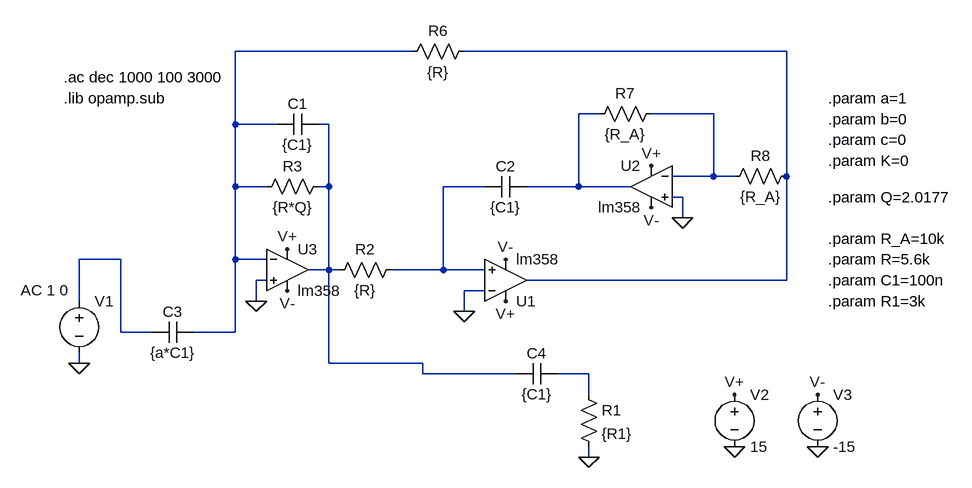
[diagram p0: schematic Labo1_V2.asc]
Labo1_V2.asc, the LTspice schematic file:
Version 4.1
SHEET 1 1576 828
WIRE 224 -192 -48 -192
WIRE 800 -192 304 -192
WIRE 512 -96 480 -96
WIRE 688 -96 592 -96
WIRE -48 -80 -48 -192
WIRE 16 -80 -48 -80
WIRE 96 -80 80 -80
WIRE 688 0 688 -96
WIRE 688 0 624 0
WIRE 720 0 688 0
WIRE 800 0 800 -192
WIRE -48 16 -48 -80
WIRE 0 16 -48 16
WIRE 96 16 96 -80
WIRE 96 16 80 16
WIRE 336 16 272 16
WIRE 480 16 480 -96
WIRE 480 16 400 16
WIRE 560 16 480 16
WIRE 640 32 624 32
WIRE 640 64 640 32
WIRE -224 128 -288 128
WIRE -48 128 -48 16
WIRE 0 128 -48 128
WIRE 96 144 96 16
WIRE 96 144 64 144
WIRE 112 144 96 144
WIRE 272 144 272 16
WIRE 272 144 192 144
WIRE 336 144 272 144
WIRE 0 160 -16 160
WIRE 800 160 800 0
WIRE 800 160 400 160
WIRE 336 176 304 176
WIRE -288 192 -288 128
WIRE -16 192 -16 160
WIRE 304 208 304 176
WIRE -224 240 -224 128
WIRE -176 240 -224 240
WIRE -48 240 -48 128
WIRE -48 240 -112 240
WIRE -288 288 -288 272
WIRE 96 288 96 144
WIRE 240 288 96 288
WIRE 240 304 240 288
WIRE 384 304 240 304
WIRE 496 304 448 304
WIRE 496 336 496 304
WIRE 496 432 496 416
FLAG -16 192 0
FLAG 304 208 0
FLAG -288 288 0
FLAG 640 64 0
FLAG 496 432 0
FLAG 720 416 0
FLAG 848 416 0
FLAG 720 336 V+
FLAG 848 336 V-
FLAG 368 192 V+
FLAG 32 112 V+
FLAG 592 -16 V+
FLAG 368 128 V-
FLAG 592 48 V-
FLAG 32 176 V-
SYMBOL voltage -288 176 R0
WINDOW 123 -90 -1 Left 2
WINDOW 39 0 0 Left 0
SYMATTR Value2 AC 1 0
SYMATTR InstName V1
SYMATTR Value ""
SYMBOL res 208 128 R90
WINDOW 0 0 56 VBottom 2
WINDOW 3 32 56 VTop 2
SYMATTR InstName R2
SYMATTR Value {R}
SYMBOL res 96 0 R90
WINDOW 0 0 56 VBottom 2
WINDOW 3 32 56 VTop 2
SYMATTR InstName R3
SYMATTR Value {R*Q}
SYMBOL cap 80 -96 R90
WINDOW 0 0 32 VBottom 2
WINDOW 3 32 32 VTop 2
SYMATTR InstName C1
SYMATTR Value {C1}
SYMBOL res 320 -208 R90
WINDOW 0 0 56 VBottom 2
WINDOW 3 32 56 VTop 2
SYMATTR InstName R6
SYMATTR Value {R}
SYMBOL cap 400 0 R90
WINDOW 0 0 32 VBottom 2
WINDOW 3 32 32 VTop 2
SYMATTR InstName C2
SYMATTR Value {C1}
SYMBOL res 608 -112 R90
WINDOW 0 0 56 VBottom 2
WINDOW 3 32 56 VTop 2
SYMATTR InstName R7
SYMATTR Value {R_A}
SYMBOL res 816 -16 R90
WINDOW 0 0 56 VBottom 2
WINDOW 3 32 56 VTop 2
SYMATTR InstName R8
SYMATTR Value {R_A}
SYMBOL cap -112 224 R90
WINDOW 0 0 32 VBottom 2
WINDOW 3 32 32 VTop 2
SYMATTR InstName C3
SYMATTR Value {a*C1}
SYMBOL cap 448 288 R90
WINDOW 0 0 32 VBottom 2
WINDOW 3 32 32 VTop 2
SYMATTR InstName C4
SYMATTR Value {C1}
SYMBOL res 480 320 R0
SYMATTR InstName R1
SYMATTR Value {R1}
SYMBOL voltage 720 320 R0
WINDOW 123 0 0 Left 0
WINDOW 39 0 0 Left 0
SYMATTR InstName V2
SYMATTR Value 15
SYMBOL voltage 848 320 R0
WINDOW 123 0 0 Left 0
WINDOW 39 0 0 Left 0
SYMATTR InstName V3
SYMATTR Value -15
SYMBOL lm358 368 224 M180
SYMATTR InstName U1
SYMBOL lm358 592 -48 M0
SYMATTR InstName U2
SYMBOL lm358 32 80 R0
SYMATTR InstName U3
TEXT -312 -152 Left 2 !.ac dec 1000 100 3000
TEXT -312 -120 Left 2 !.lib opamp.sub
TEXT 864 -120 Left 2 !.param a=1
TEXT 864 -88 Left 2 !.param b=0
TEXT 864 -56 Left 2 !.param c=0
TEXT 864 -24 Left 2 !.param K=0
TEXT 864 32 Left 2 !.param Q=2.0177
TEXT 864 96 Left 2 !.param R_A=10k
TEXT 864 128 Left 2 !.param R=5.6k
TEXT 864 160 Left 2 !.param C1=100n
TEXT 864 192 Left 2 !.param R1=3k

The netlist it stands for:
* Labo1_V2.asc
V1 N007 0 AC 1 0
R2 N006 N005 {R}
R3 N005 N001 {R*Q}
C1 N005 N001 {C1}
R6 N002 N001 {R}
C2 N003 N006 {C1}
R7 N004 N003 {R_A}
R8 N002 N004 {R_A}
C3 N001 N007 {a*C1}
C4 N008 N005 {C1}
R1 N008 0 {R1}
V2 V+ 0 15
V3 V- 0 -15
* U1: lm358 (symbol lm358 not available, pins judged from their places): In+=N006 In-=0 V+=V+ V-=V- OUT=N002
* U2: lm358 (symbol lm358 not available, pins judged from their places): In+=0 In-=N004 V+=V+ V-=V- OUT=N003
* U3: lm358 (symbol lm358 not available, pins judged from their places): In+=0 In-=N001 V+=V+ V-=V- OUT=N005
.ac dec 1000 100 3000
.lib opamp.sub
.param a=1
.param b=0
.param c=0
.param K=0
.param Q=2.0177
.param R_A=10k
.param R=5.6k
.param C1=100n
.param R1=3k
.backanno
.end